# Altium schematic sheet Ethernet_Connector.SchDoc
size A4; CompanyName: Technische Hochschule Nürnberg Georg Simon Ohm; Organization: UltraZohm; Address1: Kesslerplatz 12; Address2: 90489 Nürnberg; Address3: GERMANY; SheetNumber: 5; SheetTotal: 5; Website: www.ultrazohm.com
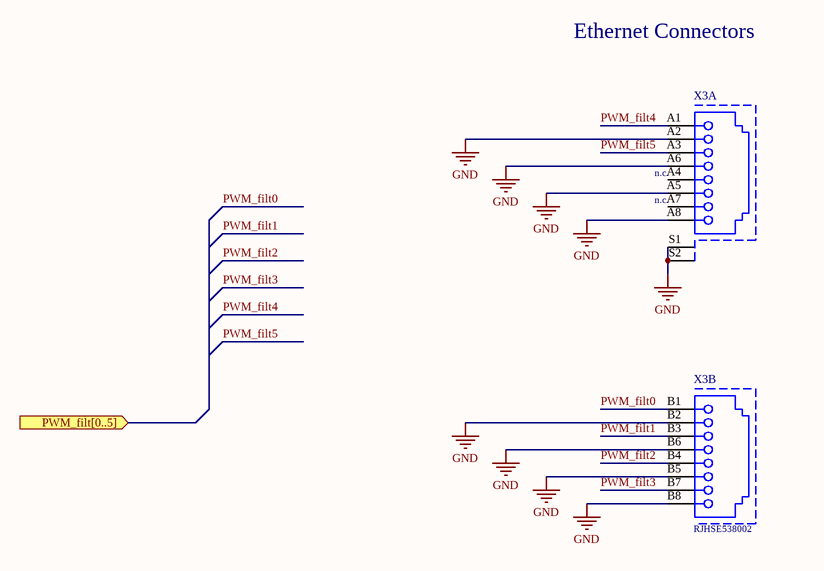
[diagram p0: Ethernet_Connector.SchDoc]

## Parts
X3  (no value)  [RJHSE-5380-02]  (parts A,B of 2)

## Ports
PWM_filt[0..5] (in)

## Nets
GND: X3.A2 X3.A5 X3.A6 X3.A8 X3.B2 X3.B5 X3.B6 X3.B8 X3.S1 X3.S2
PWM_filt0: X3.B1
PWM_filt1: X3.B3
PWM_filt2: X3.B4
PWM_filt3: X3.B7
PWM_filt4: X3.A1
PWM_filt5: X3.A3

Not connected (* = marked no-connect by the designer): X3 A4 A7

## Notes on the sheet
- Ethernet Connectors
- (near X3) n.c.
- Title
- Revision:
- Design Engineer:
- Date:
- Project:
- Sheet
- of

## Library data of the parts
X3 = RJHSE538002: CAT5, RJ45 Connector, 1x2; Manufacturer: Amphenol; Created from: MGremer; Manufacturer Part Number: RJHSE538002; PartID: 4; Created On: 22.02.2021 16:43:38; ComponentLink1Description: Datasheet; ComponentLink1URL: https://www.farnell.com/cad/2360382.pdf; Component Type: RJ45 Connector; Device Package: RJ45; Last Updated: 22.02.2021 16:43:38; Mounting Type: THT; Series: RJHSE; Supplier 1: Farnell; Supplier Part Number 1: 1860605; Type: RJ45 Connector; Live Cycle Status: 1; Stock number: not stored; LCSC Part Number: C47326523